# Altium schematic sheet IM828XCC.SchDoc
size A4; CompanyName: Technische Hochschule Nürnberg Georg Simon Ohm; Organization: UltraZohm; Address1: Kesslerplatz 12; Address2: 90489 Nürnberg; Address3: GERMANY; Website: www.ultrazohm.com
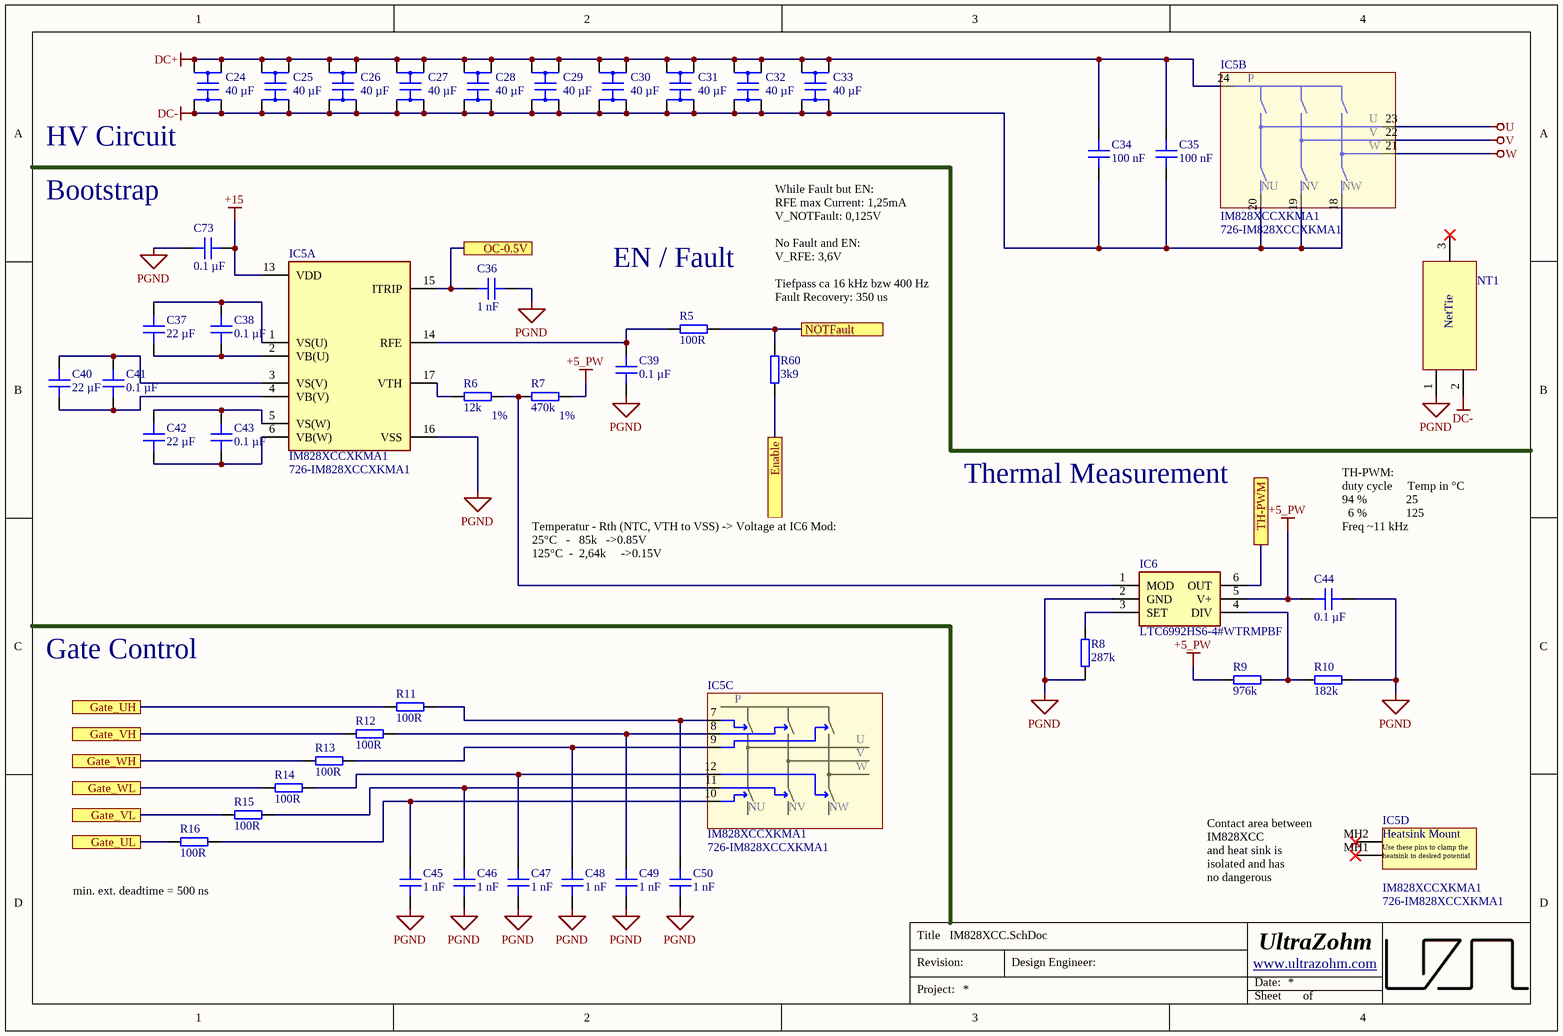
[diagram p0: IM828XCC.SchDoc]

## Parts
C24  40 µF  [B32778Z]
C25  40 µF  [B32778Z]
C26  40 µF  [B32778Z]
C27  40 µF  [B32778Z]
C28  40 µF  [B32778Z]
C29  40 µF  [B32778Z]
C30  40 µF  [B32778Z]
C31  40 µF  [B32778Z]
C32  40 µF  [B32778Z]
C33  40 µF  [B32778Z]
C34  100 nF  [WIMA]
C35  100 nF  [WIMA]
C36  1 nF  [C_0603]
C37  22 µF  [C_1206]
C38  0.1 µF  [C_0603]
C39  0.1 µF  [C_0603]
C40  22 µF  [C_1206]
C41  0.1 µF  [C_0603]
C42  22 µF  [C_1206]
C43  0.1 µF  [C_0603]
C44  0.1 µF  [C_0603]
C45  1 nF  [C_0603]
C46  1 nF  [C_0603]
C47  1 nF  [C_0603]
C48  1 nF  [C_0603]
C49  1 nF  [C_0603]
C50  1 nF  [C_0603]
C73  0.1 µF  [C_0603]
IC5  IM828XCCXKMA1  Supplier Part Number 1: 726-IM828XCCXKMA1  [IM828XCCXKMA1]  (parts A,B,C,D of 4)
IC6  LTC6992HS6-4#WTRMPBF  [SOT95P280X100-6N]
NT1  Net Tie 2 to 1  [2_to_1_NetTie_1mm]  (value not drawn)  (net tie, no BOM)
R5  100R  [RES 0603_1608]
R6  12k  Tolerance: 1%  [RES 0603_1608]
R7  470k  Tolerance: 1%  [RES 0603_1608]
R8  287k  [RES 0805_2012]
R9  976k  [RES 0603_1608]
R10  182k  [RES 0603_1608]
R11  100R  [RES 0603_1608]
R12  100R  [RES 0603_1608]
R13  100R  [RES 0603_1608]
R14  100R  [RES 0603_1608]
R15  100R  [RES 0603_1608]
R16  100R  [RES 0603_1608]
R60  3k9  [RES 0603_1608]

## Ports
Enable, Gate_UH, Gate_UL, Gate_VH, Gate_VL, Gate_WH, Gate_WL, NOTFault, OC-0.5V, TH-PWM

## Nets
+5_PW: C44.2 IC6.5(V+) R7.2 R9.1
+15: C73.1 IC5.13(VDD)
DC+: C24.2 C24.3 C25.2 C25.3 C26.2 C26.3 C27.2 C27.3 C28.2 C28.3 C29.2 C29.3 C30.2 C30.3 C31.2 C31.3 C32.2 C32.3 C33.2 C33.3 C34.2 C35.2 IC5.24(P)
DC-: C24.1 C24.4 C25.1 C25.4 C26.1 C26.4 C27.1 C27.4 C28.1 C28.4 C29.1 C29.4 C30.1 C30.4 C31.1 C31.4 C32.1 C32.4 C33.1 C33.4 C34.1 C35.1 IC5.18(NW) IC5.19(NV) IC5.20(NU) NT1.2
PGND: C36.1 C39.1 C44.1 C45.1 C46.1 C47.1 C48.1 C49.1 C50.1 C73.2 IC5.16(VSS) IC6.2(GND) NT1.1 R8.1 R10.2
U: IC5.23(U)
V: IC5.22(V)
W: IC5.21(W)
Enable: R60.1 ; port Enable
Gate_UH: R11.1 ; port Gate_UH
Gate_UL: R16.1 ; port Gate_UL
Gate_VH: R12.1 ; port Gate_VH
Gate_VL: R15.1 ; port Gate_VL
Gate_WH: R13.1 ; port Gate_WH
Gate_WL: R14.1 ; port Gate_WL
NOTFault: R5.2 R60.2 ; port NOTFault
OC-0.5V: C36.2 IC5.15(ITRIP) ; port OC-0.5V
TH-PWM: IC6.6(OUT) ; port TH-PWM
NetC37_1: C37.1 C38.1 IC5.2(VB(U))
NetC37_2: C37.2 C38.2 IC5.1(VS(U))
NetC39_2: C39.2 IC5.14(RFE) R5.1
NetC40_1: C40.1 C41.1 IC5.4(VB(V))
NetC40_2: C40.2 C41.2 IC5.3(VS(V))
NetC42_1: C42.1 C43.1 IC5.6(VB(W))
NetC42_2: C42.2 C43.2 IC5.5(VS(W))
NetC45_2: C45.2 IC5.10(LIN(U)) R16.2
NetC46_2: C46.2 IC5.11(LIN(V)) R15.2
NetC47_2: C47.2 IC5.12(LIN(W)) R14.2
NetC48_2: C48.2 IC5.9(HIN(W)) R13.2
NetC49_2: C49.2 IC5.8(HIN(V)) R12.2
NetC50_2: C50.2 IC5.7(HIN(U)) R11.2
NetIC5_17: IC5.17(VTH) R6.1
NetIC6_1: IC6.1(MOD) R6.2 R7.1
NetIC6_3: IC6.3(SET) R8.2
NetIC6_4: IC6.4(DIV) R9.2 R10.1

Not connected (* = marked no-connect by the designer): IC5 MH1(HeatsinkScrew)* MH2(HeatsinkScrew2)*; NT1 3*

## Notes on the sheet
- (near C24) HV Circuit
- (near C73) Bootstrap
- EN / Fault
- (near R60) While Fault but EN:
  RFE max Current: 1,25mA
  V_NOTFault: 0,125V
  No Fault and EN:
  V_RFE: 3,6V
  Tiefpass ca 16 kHz bzw 400 Hz
  Fault Recovery: 350 us
- Thermal Measurement
- Temperatur - Rth (NTC, VTH to VSS) -> Voltage at IC6 Mod:
  25°C   -   85k   ->0.85V
  125°C  -  2,64k     ->0.15V
- (near C44) TH-PWM:
  duty cycle     Temp in °C
  94 %             25
  6 %             125
  Freq ~11 kHz
- Gate Control
- (near R16) min. ext. deadtime = 500 ns
- Contact area between IM828XCC
  and heat sink is isolated and has
  no dangerous potential
- Title
- Revision:
- Design Engineer:
- Date:
- Project:
- Sheet
- of
- (in symbol IM828XCCXKMA1, part D) Heatsink Mount; Use these pins to clamp the heatsink to desired potential
- (in symbol Net Tie 2 to 1) NetTie

## Library data of the parts
C24-C33 = B32778Z0406K000: Film Capacitors, 40 µF, 1000 VDC for DC Link; Manufacturer: EPCOS / TDK; Tolerance: 10%; Created from: VStarost; Manufacturer Part Number: B32778Z0406K000; PartID: 6; Created On: 14.12.2022 12:52:42; ComponentLink1Description: Datasheet; ComponentLink1URL: https://product.tdk.com/system/files/dam/doc/product/capacitor/film/mkp_mfp/data_sheet/20/20/ds/mkp_b32774xyz_778xyz.pdf; Component Type: Capacitor; Device Package: THT; Last Updated: 14.12.2022 12:52:42; Mounting Type: THT; Operating Temperature: -40 - 105°C; Series: B3277_X/Y/Z; Supplier 1: Mouser; Supplier Part Number 1: 871-B32778Z0406K000; Type: Capacitor; Voltage Rating: 1000 VDC; Value: 40 µF; Live Cycle Status: 1; Stock number: not stored
C34 C35 = MKP1T031006B00KYSD: Folienkondensatoren 1600V .10uF 10% PCM 27.5; Voltage Rating: 1600 VDC; Created from: VStarost; Manufacturer Part Number: MKP1T031006B00KYSD; PartID: 7; Created On: 02.02.2023 13:58:40; ComponentLink1Description: DatasheetDatasheet; ComponentLink1URL: https://www.mouser.de/datasheet/2/440/e_WIMA_MKP_10-1139811.pdf; Component Type: Capacitor; Device Package: THT; Last Updated: 02.02.2023 14:01:18; Manufacturer: WIMA; Mounting Type: THT; Operating Temperature: -55 - 100°C; Series: MKP10; Supplier 1: Mouser; Supplier Part Number 1: 505-M10.1/1600/10P; Type: Capacitor; Tolerance: 10%; Value: 100 nF; Live Cycle Status: 1; Stock number: not stored
C36 C45-C50 = 06035A102JAT2A: Capacitor 0603, 50 VDC, 1 nF, C0G; Manufacturer: AVX; Tolerance: 5 %; Voltage Rating: 50 VDC; Created from: MGremer; Manufacturer Part Number: 06035A102JAT2A; PartID: 57; Created On: 20.12.2020 13:54:13; ComponentLink1Description: Datasheet; ComponentLink1URL: https://www.mouser.de/datasheet/2/40/C0GNP0_Dielectric-951274.pdf; Component Type: Capacitor 0603; Device Package: 0603; Last Updated: 15.02.2023 13:44:24; Mounting Type: SMD; Operating Temperature: -55 - 125°C; Series: C0G; Supplier 1: Mouser; Supplier Part Number 1: 581-06035A102J; Type: Capacitor; Value: 1 nF; Live Cycle Status: 1; Stock number: not stored; LCSC Part Number: C106246
C37 C40 C42 = C3216X5R1V226M160AC: Capacitor 1206, 35 VDC, 22µF, X5R; Manufacturer: TDK; Tolerance: 20 %; Voltage Rating: 35 VDC; Created from: VStarost; Manufacturer Part Number: C3216X5R1V226M160AC; PartID: 116; Created On: 14.12.2022 12:32:58; ComponentLink1Description: Datasheet; ComponentLink1URL: https://product.tdk.com/system/files/dam/doc/product/capacitor/ceramic/mlcc/catalog/mlcc_commercial_general_en.pdf; Component Type: Capacitor 1206; Device Package: 1206; Last Updated: 14.12.2022 12:38:27; Mounting Type: SMD; Operating Temperature: -55 - 85°C; Series: C; Supplier 1: Mouser; Supplier Part Number 1: 810-C3216X5R1V226M; Type: Capacitor; Value: 22 µF; Live Cycle Status: 1; Stock number: KA126
C38 C39 C41 C43 C44 C73 = C0603X104K5RAC7411: Capacitor 0603, 50 VDC, 0.1 µF, X7R; Manufacturer: KEMET; Tolerance: 10 %; Voltage Rating: 50 VDC; Created from: MGremer; Manufacturer Part Number: C0603X104K5RAC7411; PartID: 3; Created On: 20.12.2020 13:54:13; ComponentLink1Description: Datasheet; ComponentLink1URL: https://www.mouser.de/datasheet/2/212/1/KEM_C1013_X7R_FT_CAP_SMD-1103280.pdf; Component Type: Capacitor 0603; Device Package: 0603; Last Updated: 04.03.2021 09:24:28; Mounting Type: SMD; Operating Temperature: -55 - 125°C; Series: SMD Comm X7R Flex; Supplier 1: Mouser; Supplier Part Number 1: 80-C0603X104K5R7411; Supplier 2: LCSC; Supplier Part Number 2: C14663; Type: Capacitor; Value: 0.1 µF; Live Cycle Status: 1; LCSC Part Number: C14663; Stock number: Labor SMD Container
IC5 = IM828XCCXKMA1: Motor/Motion/Ignition Controllers & Drivers SiC MOSFET; Manufacturer_Name: Infineon; Value: 900V 20A; Created from: VStarost; Datasheet Link: https://www.infineon.com/dgdl/Infineon-IM828-XCC-DataSheet-v02_00-EN.pdf?fileId=5546d4627448fb2b0174583d4d6d430c; Height: 5.6mm; Manufacturer_Part_Number: IM828XCCXKMA1; Mouser Part Number: 726-IM828XCCXKMA1; Mouser Price/Stock: https://www.mouser.co.uk/ProductDetail/Infineon-Technologies/IM828XCCXKMA1?qs=hWgE7mdIu5TmWfF0vabtqA%3D%3D; Supplier 1: Mouser; Manufacturer Part Number: IM828XCCXKMA1; PartID: 24; Created On: 13.12.2022 10:03:41; ComponentLink1Description: Datasheet; ComponentLink1URL: https://www.infineon.com/dgdl/Infineon-IM828-XCC-DataSheet-v02_01-EN.pdf?fileId=5546d4627448fb2b0174583d4d6d430c; Component Type: Inverter Module; Device Package: DIP 36x23D; Last Updated: 13.12.2022 10:03:41; Manufacturer: Infineon; Mounting Type: THT; Operating Temperature: -40 - 125 °C; Series: CIPOS™ Maxi IM828; Type: Inverter Module; Live Cycle Status: 1; Stock number: not stored
IC6 = LTC6992HS6-4#WTRMPBF: Switching Controllers PWM with 5% to 100% Pulse Width Control; Manufacturer: Analog Devices; Created from: DHufnagel; Manufacturer Part Number: LTC6992HS6-4#WTRMPBF; PartID: 9; Created On: 20.07.2022 14:30:26; ComponentLink1Description: Datasheet; ComponentLink1URL: https://www.mouser.de/datasheet/2/609/LTC6992-1-6992-2-6992-3-6992-4-1852873.pdf; Component Type: Switching Controllers; Device Package: SOT-23-6; Last Updated: 20.07.2022 14:30:26; Mounting Type: SMD; Operating Temperature: -40 - 125°C; Supplier 1: Mouser; Supplier Part Number 1: 584-6992HS64WTRMPBF; Type: Switching Controller; Live Cycle Status: 1; Stock number: not stored
NT1 = Net Tie 2 to 1: Net Tie 2 to 1. Joints two nets without producing a DRC error; PartID: 1; Created On: 26.02.2021 18:37:51; Component Type: Net Tie 2 to 1; Last Updated: 26.02.2021 18:44:55; Type: Net Tie (No BOM); Created by: T. Wendt; Live Cycle Status: 1
R5 R11-R16 = RK73B1JTTD101J: SMD resistor E24 series; Manufacturer: KOA Speer; Tolerance: 5%; Created from: MGremer; Manufacturer Part Number: RK73B1JTTD101J; PartID: 50; Created On: 14.12.2020 16:17:14; ComponentLink1Description: Datasheet; ComponentLink1URL: https://www.mouser.de/datasheet/2/219/RK73B-1825463.pdf; Component Type: SMD resistor; Device Package: 0603; Last Updated: 29.11.2022 14:30:07; Mounting Type: SMD; Supplier 1: Mouser; Supplier Part Number 1: 660-RK73B1JTTD101J; Supplier 2: LCSC; Supplier Part Number 2: C22775; Type: Resistor; Value: 100R; Live Cycle Status: 1; Stock number: Labor SMD Container; LCSC Part Number: C22775
R6 = AC0603FR-1012KL: SMD resistor E24 series 12 kOhms 100mW 0603 1%; Manufacturer: YAGEO; Created from: VStarost; Manufacturer Part Number: AC0603FR-1012KL; PartID: 257; Created On: 10.02.2023 10:27:45; ComponentLink1Description: Datasheet; ComponentLink1URL: https://www.mouser.de/datasheet/2/447/PYu_AC_51_RoHS_L_9-3005297.pdf; Component Type: SMD resistor; Device Package: 0603; Last Updated: 15.02.2023 17:38:28; Mounting Type: SMD; Supplier 1: Mouser; Supplier Part Number 1: 603-AC0603FR-1012KL; Type: Resistor; Value: 12k; Live Cycle Status: 1; Stock number: not stored; LCSC Part Number: C844123
R7 = RC0603FR-10470KL: SMD resistor E24 series 470 kOhms 100-200 mW 0603 1%; Manufacturer: YAGEO; Created from: VStarost; Manufacturer Part Number: RC0603FR-10470KL; PartID: 258; Created On: 10.02.2023 10:29:56; ComponentLink1Description: Datasheet; ComponentLink1URL: https://www.mouser.de/datasheet/2/447/PYu_RC_Group_51_RoHS_L_11-1984063.pdf; Component Type: SMD resistor; Device Package: 0603; Last Updated: 15.02.2023 17:51:10; Mounting Type: SMD; Supplier 1: Mouser; Supplier Part Number 1: 603-RC0603FR-10470KL; Type: Resistor; Value: 470k; Live Cycle Status: 1; Stock number: not stored; LCSC Part Number: C294664
R8 = ERJ-6ENF2873V: SMD resistor 1%; Manufacturer: Panasonic; Created from: MGremer; Manufacturer Part Number: ERJ-6ENF2873V; PartID: 154; Created On: 14.12.2020 16:17:14; ComponentLink1Description: Datasheet; ComponentLink1URL: https://www.mouser.de/datasheet/2/315/AOA0000C304-1149620.pdf; Component Type: SMD resistor; Device Package: 0805; Last Updated: 15.02.2023 18:07:29; Mounting Type: SMD; Supplier 1: Mouser; Supplier Part Number 1: 667-ERJ-6ENF2873V; Type: Resistor; Tolerance: 1%; Value: 287k; Live Cycle Status: 1; Stock number: not stored; LCSC Part Number: C228683
R9 = CR0603-FX-9763ELF: SMD resistor 1%, 50V, 100ppm; Manufacturer: Bourns; Created from: DHufnagel; Manufacturer Part Number: CR0603-FX-9763ELF; PartID: 234; Created On: 25.07.2022 08:26:35; ComponentLink1Description: Datasheet; ComponentLink1URL: https://www.mouser.de/datasheet/2/54/cr-1858361.pdf; Component Type: SMD resistor; Device Package: 0603; Last Updated: 15.02.2023 18:14:05; Mounting Type: SMD; Supplier 1: Mouser; Supplier Part Number 1: 652-CR0603FX-9763ELF; Type: Resistor; Tolerance: 1%; Value: 976k; Live Cycle Status: 1; Stock number: not stored; LCSC Part Number: C162980
R10 = CR0603-FX-1823ELF: SMD resistor 1%, 50V, 100ppm; Manufacturer: Bourns; Created from: DHufnagel; Manufacturer Part Number: CR0603-FX-1823ELF; PartID: 235; Created On: 25.07.2022 08:26:35; ComponentLink1Description: Datasheet; ComponentLink1URL: https://www.mouser.de/datasheet/2/54/cr-1858361.pdf; Component Type: SMD resistor; Device Package: 0603; Last Updated: 15.02.2023 18:09:14; Mounting Type: SMD; Supplier 1: Mouser; Supplier Part Number 1: 652-CR0603FX-1823ELF; Type: Resistor; Tolerance: 1%; Value: 182k; Live Cycle Status: 1; Stock number: not stored; LCSC Part Number: C203368
R60 = RK73B1JTTDD392J: SMD resistor E24 series; Manufacturer: KOA Speer; Tolerance: 5%; Created from: MGremer; Manufacturer Part Number: RK73B1JTTDD392J; PartID: 88; Created On: 14.12.2020 16:17:14; ComponentLink1Description: Datasheet; ComponentLink1URL: https://www.mouser.de/datasheet/2/219/RK73B-1825463.pdf; Component Type: SMD resistor; Device Package: 0603; Last Updated: 15.02.2023 17:47:58; Mounting Type: SMD; Supplier 1: Mouser; Supplier Part Number 1: 660-RK73B1JTTDD392J; Type: Resistor; Value: 3k9; Live Cycle Status: 1; Stock number: Labor SMD Container; LCSC Part Number: C177310